# Altium schematic sheet ESP32_Module.SchDoc: ESP32-WROOM32D Module
size A4; DocumentNumber: 15; SheetNumber: 15; SheetTotal: 51
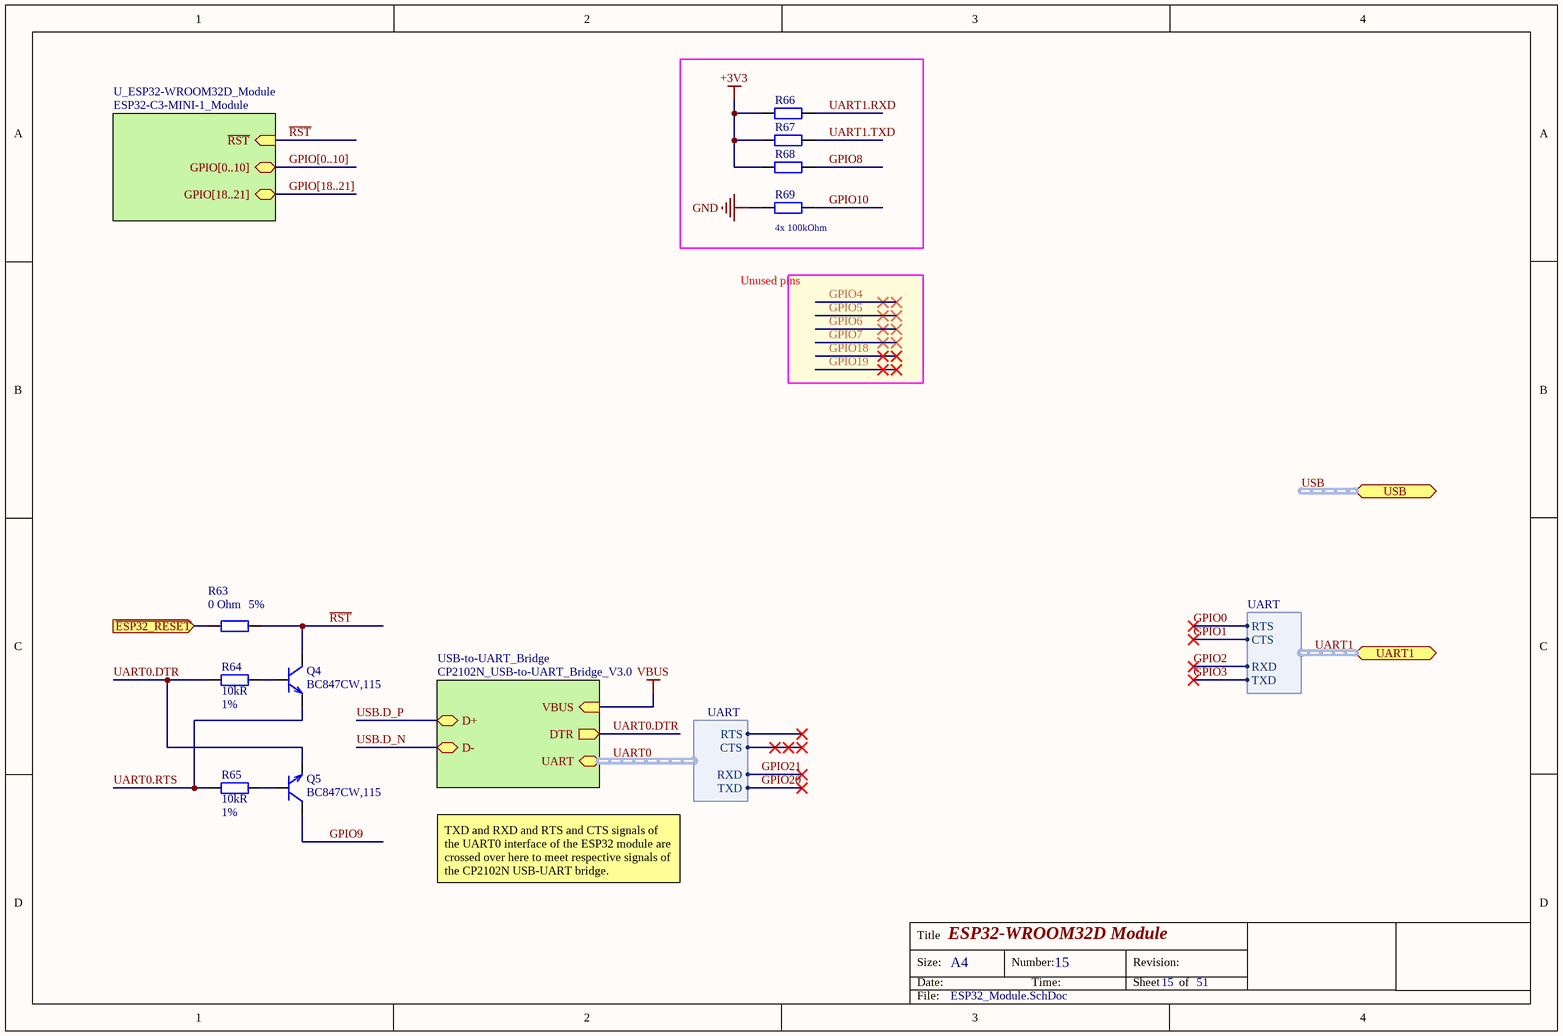
[diagram p0: ESP32_Module.SchDoc]

## Parts
Q4  BC847CW,115  [SOT-323]
Q5  BC847CW,115  [SOT-323]
R63  Tolerance: 5%  Resistance: 0 Ohm  [R0402]  (hidden comment: RES SMD 0 OHM JUMPER 1/16W 0402)
R64  Resistance: 10kR  Tolerance: 1%  [R0402]  (hidden comment: RES SMD 10K OHM 1% 1/16W 0402)
R65  Resistance: 10kR  Tolerance: 1%  [R0402]  (hidden comment: RES SMD 10K OHM 1% 1/16W 0402)
R66  RES SMD 100K OHM 1% 1/16W 0402  [R0402]  (value not drawn)
R67  RES SMD 100K OHM 1% 1/16W 0402  [R0402]  (value not drawn)
R68  RES SMD 100K OHM 1% 1/16W 0402  [R0402]  (value not drawn)
R69  RES SMD 100K OHM 1% 1/16W 0402  [R0402]  (value not drawn)

## Blocks framed on the sheet
4x 100kOhm: R66-R69

## Sub-sheets
U_ESP32-WROOM32D_Module = ESP32-C3-MINI-1_Module: ~{RST} (in), GPIO[18..21], GPIO[0..10]
USB-to-UART_Bridge = CP2102N_USB-to-UART_Bridge_V3.0: VBUS (in), D+ (bidir), D- (bidir), UART (harness UART), DTR (out)

## Ports
UART1 (harness UART), USB (harness USB), ~{ESP32_RESET} (in)

## Harnesses
UART: RTS, CTS, RXD, TXD

## Nets
+3V3: R66.1 R67.1 R68.1
GND: R69.1
VBUS: sheet USB-to-UART_Bridge/VBUS
~{ESP32_RESET}: R63.1 ; port ~{ESP32_RESET}
~{RST}: Q4.3(C) R63.2 ; sheet U_ESP32-WROOM32D_Module/~{RST}
GPIO0: port UART1.RTS
GPIO1: port UART1.CTS
GPIO2: port UART1.RXD
GPIO3: port UART1.TXD
GPIO8: R68.2
GPIO9: Q5.3(C)
GPIO10: R69.2
GPIO20: sheet USB-to-UART_Bridge/UART.TXD
GPIO21: sheet USB-to-UART_Bridge/UART.RXD
UART0.DTR: Q5.2(E) R64.1 ; sheet USB-to-UART_Bridge/DTR
UART0.RTS: Q4.2(E) R65.1
UART1.RXD: R66.2
UART1.TXD: R67.2
USB.D_N: sheet USB-to-UART_Bridge/D-
USB.D_P: sheet USB-to-UART_Bridge/D+
NetQ4_1: Q4.1(B) R64.2
NetQ5_1: Q5.1(B) R65.2

## Buses and harness runs
bus GPIO[0..10] = sheet U_ESP32-WROOM32D_Module/GPIO[0..10]
bus GPIO[18..21] = sheet U_ESP32-WROOM32D_Module/GPIO[18..21]
harness UART0 = sheet USB-to-UART_Bridge/UART
harness UART1 = port UART1
harness USB = port USB

## Notes on the sheet
- Unused pins
- TXD and RXD and RTS and CTS signals of the UART0 interface of the ESP32 module are crossed over here to meet respective signals of the CP2102N USB-UART bridge.
- Title
- Size:
- Date:
- A4
- Number:
- Time:
- Revision:
- Sheet
- of
- File:

## Library data of the parts
Q4 Q5 = TRANS BC847CW,115 NPN 45V 0.1A SOT323: Bipolar (BJT) Transistor NPN 45V 100mA 100MHz 200mW Surface Mount SOT-323-3; Manufacturer: Nexperia; Supplier 1: Digi-Key; Manufacturer Part Number: BC847CW,115; Stock 1: 327256; Pricing 1: 1=0.13, 10=0.118, 25=0.1124, 100=0.0495, 250=0.0475, 500=0.0389, 1000=0.027 (USD); ComponentLink1URL: http://www.farnell.com/datasheets/1856333.pdf?src-supplier=Farnell; ComponentLink1Description: http://www.farnell.com/datasheets/1856333.pdf?src-supplier=Farnell; ComponentLink2URL: http://www.farnell.com/datasheets/1856333.pdf?src-supplier=Element14; ComponentLink2Description: http://www.farnell.com/datasheets/1856333.pdf?src-supplier=Element14; ComponentLink3URL: https://assets.nexperia.com/documents/data-sheet/BC847_SER.pdf?src-supplier=Digi-Key; ComponentLink3Description: https://assets.nexperia.com/documents/data-sheet/BC847_SER.pdf?src-supplier=Digi-Key; ComponentLink4URL: http://www.farnell.com/datasheets/1856333.pdf?src-supplier=Newark; ComponentLink4Description: http://www.farnell.com/datasheets/1856333.pdf?src-supplier=Newark; Supplier Part Number 1: 1727-4312-1-ND; ClassName: U_ESP32-WROOM32D_Module; Mount: Surface Mount
R63 = RES SMD 0 OHM JUMPER 1/16W 0402: 0 Ohms Jumper 0.063W, 1/16W Chip Resistor 0402 (1005 Metric) Moisture Resistant Thick Film; Manufacturer: Yageo; Manufacturer Part Number: RC0402JR-070RL; Power Rating: 62.5mW; Voltage Rating: 50V; Max Power Dissipation: 63mW; Temperature Coefficient: 200ppm/°C; Supplier 1: Digi-Key; Stock 1: 46057148; Pricing 1: 1=0.1, 10=0.013, 25=0.0092, 50=0.0072, 100=0.0053, 250=0.004, 500=0.0032, 1000=0.0024, 5000=0.0017 (USD); Contact Plating: Tin,Matte; Case Code (Metric): 1005; Case Code (Imperial): 0402; Min Operating Temperature: -55°C; Max Operating Temperature: 155°C; Packaging: Tape and Reel; Composition: Thick Film; Package Quantity: 1; Number of Terminations: 2; Termination: SMD/SMT; Military Standard: Not; Features: Moisture Resistant; Length: 1mm; Height: 0.016inch; Width: 0.02inch; Depth: 0.5mm; Radiation Hardening: No; REACH SVHC: Unknown; Lead Free: Lead Free; ComponentLink1URL: http://www.yageo.com/documents/recent/PYu-RC_Group_51_RoHS_L_10.pdf?src-supplier=Digi-Key; ComponentLink1Description: http://www.yageo.com/documents/recent/PYu-RC_Group_51_RoHS_L_10.pdf?src-supplier=Digi-Key; ComponentLink2URL: http://www.yageo.com/documents/recent/PYu-RC0402_51_RoHS_L_6.pdf?src-supplier=Avnet+Europe; ComponentLink2Description: http://www.yageo.com/documents/recent/PYu-RC0402_51_RoHS_L_6.pdf?src-supplier=Avnet+Europe; ComponentLink3URL: http://www.farnell.com/datasheets/1018594.pdf?src-supplier=Element14; ComponentLink3Description: http://www.farnell.com/datasheets/1018594.pdf?src-supplier=Element14; ComponentLink4URL: https://www.verical.com/server-webapp/html/getDatasheet?partID=326379&src-supplier=Verical; ComponentLink4Description: https://www.verical.com/server-webapp/html/getDatasheet?partID=326379&src-supplier=Verical; ComponentLink5URL: http://www.farnell.com/datasheets/2167052.pdf?src-supplier=Element14; ComponentLink5Description: http://www.farnell.com/datasheets/2167052.pdf?src-supplier=Element14; Supplier Part Number 1: 311-0.0JRCT-ND; Case/Package: 0402; ClassName: U_ESP32-WROOM32D_Module; Mount: Surface Mount
R64 R65 = RES SMD 10K OHM 1% 1/16W 0402: 10 kOhms ±1% 0.063W, 1/16W Chip Resistor 0402 (1005 Metric) Moisture Resistant Thick Film; Manufacturer Part Number: RC0402FR-0710KP; Manufacturer: Yageo; Temperature Coefficient: 150ppm/°C; Max Power Dissipation: 63mW; Supplier 1: Digi-Key; Stock 1: 839368; Pricing 1: 1=0.1, 10=0.035, 100=0.014, 1000=0.0063, 2500=0.0055, 5000=0.0045 (USD); Case Code (Imperial): 0402; Case Code (Metric): 1005; Min Operating Temperature: -55°C; Max Operating Temperature: 155°C; Composition: Thick Film; Packaging: Tape and Reel; Number of Terminations: 2; Length: 0.039inch; Height: 0.016inch; Width: 0.02inch; ComponentLink1URL: http://www.yageo.com/NewPortal/yageodocoutput?fileName=/pdf/R-Chip/PYu-RC_51_RoHS_P_0.pdf&src-supplier=Digi-Key; ComponentLink1Description: http://www.yageo.com/NewPortal/yageodocoutput?fileName=/pdf/R-Chip/PYu-RC_51_RoHS_P_0.pdf&src-supplier=Digi-Key; Supplier Part Number 1: YAG1249CT-ND; Case/Package: 0402; Features: Moisture Resistant; ClassName: U_ESP32-WROOM32D_Module; Mount: Surface Mount
R66-R69 = RES SMD 100K OHM 1% 1/16W 0402: 100 kOhms ±1% 0.063W, 1/16W Chip Resistor 0402 (1005 Metric) Moisture Resistant Thick Film; Manufacturer: Yageo; Manufacturer Part Number: RC0402FR-07100KL; Temperature Coefficient: 100ppm/°C; Power Rating: 63mW; Voltage Rating: 50V; Supplier 1: Digi-Key; Stock 1: 47448883; Pricing 1: 1=0.1, 10=0.016, 100=0.0064, 1000=0.0029, 2500=0.0025, 5000=0.0021 (USD); Case Code (Metric): 1005; Case Code (Imperial): 0402; Min Operating Temperature: -55°C; Max Operating Temperature: 155°C; Composition: Thick Film; Packaging: Tape and Reel; Package Quantity: 1; Number of Terminations: 2; Termination: SMD/SMT; Military Standard: Not; Max Power Dissipation: 63mW; Working Voltage: 50V; Features: Moisture Resistant; Length: 0.039inch; Height: 0.016inch; Width: 0.02inch; Depth: 0.5mm; REACH SVHC: No SVHC; Lead Free: Lead Free; ComponentLink1URL: http://www.yageo.com/documents/recent/PYu-RC_Group_51_RoHS_L_10.pdf?src-supplier=Digi-Key; ComponentLink1Description: http://www.yageo.com/documents/recent/PYu-RC_Group_51_RoHS_L_10.pdf?src-supplier=Digi-Key; ComponentLink2URL: http://www.farnell.com/datasheets/1018594.pdf?src-supplier=Element14; ComponentLink2Description: http://www.farnell.com/datasheets/1018594.pdf?src-supplier=Element14; ComponentLink3URL: http://www.yageo.com/documents/recent/PYu-RC_Group_51_RoHS_L_9.pdf?src-supplier=Verical; ComponentLink3Description: http://www.yageo.com/documents/recent/PYu-RC_Group_51_RoHS_L_9.pdf?src-supplier=Verical; ComponentLink4URL: http://www.yageo.com/documents/recent/PYu-RC_Group_51_RoHS_L_9.pdf?src-supplier=Mouser; ComponentLink4Description: http://www.yageo.com/documents/recent/PYu-RC_Group_51_RoHS_L_9.pdf?src-supplier=Mouser; ComponentLink5URL: http://documents.rs-components.com/techlib://itc_doclist_GB.htm?stockno=6185797&src-supplier=RSComponents; ComponentLink5Description: http://documents.rs-components.com/techlib://itc_doclist_GB.htm?stockno=6185797&src-supplier=RSComponents; Supplier Part Number 1: 311-100KLRDKR-ND; Case/Package: 0402; Tolerance: 1%; Resistance: 100 kOhm; Mount: Surface Mount